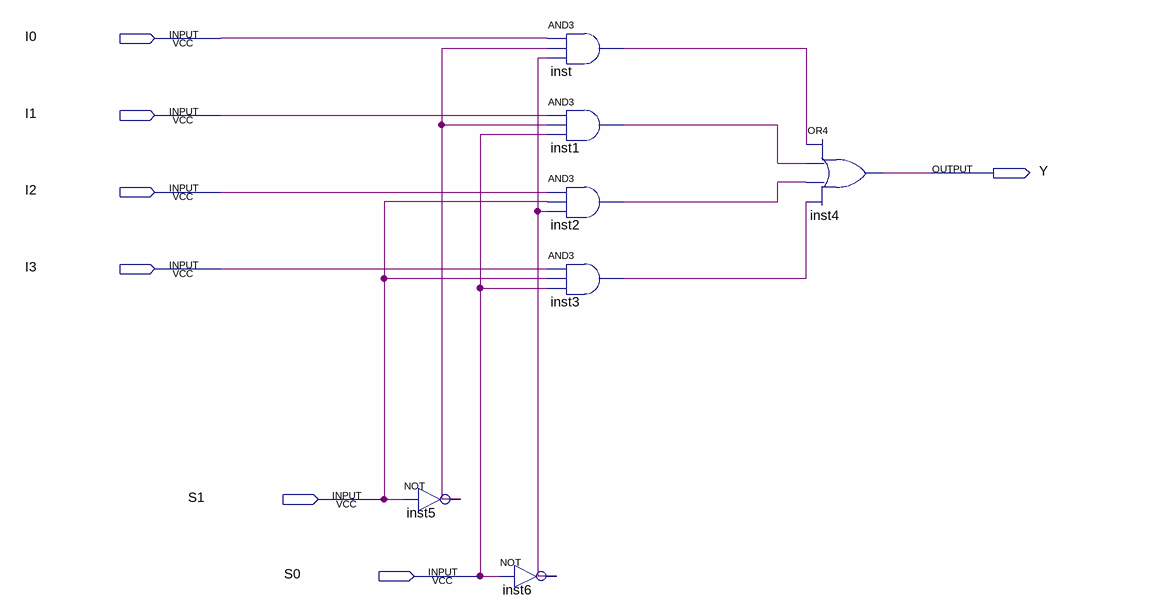
[diagram p0: schematic sheet]
// Quartus schematic Multiplexer4to1.bdf as structural Verilog: 7 symbols, 7 pins
module Multiplexer4to1 (
  input  I0,
  input  I1,
  input  I2,
  input  I3,
  input  S1,
  input  S0,
  output Y
);

  wire inst1_out, inst2_out, inst3_out, inst5_out, inst6_out, inst_out;

  not inst5 (inst5_out, S1);
  and inst (inst_out, I0, inst5_out, inst6_out);
  and inst1 (inst1_out, I1, inst5_out, S0);
  and inst2 (inst2_out, I2, S1, inst6_out);
  and inst3 (inst3_out, I3, S1, S0);
  not inst6 (inst6_out, S0);
  or inst4 (Y, inst_out, inst1_out, inst2_out, inst3_out);
endmodule
